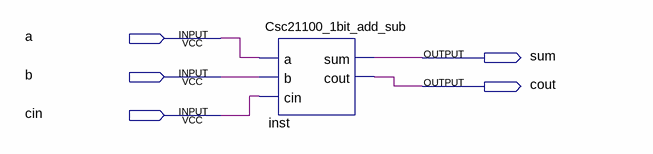
[diagram p0: schematic sheet]
// Quartus schematic Block.bdf as structural Verilog: 1 symbols, 5 pins
module Block (
  input  a,
  input  b,
  input  cin,
  output sum,
  output cout
);

  Csc21100_1bit_add_sub inst (.a(a), .b(b), .cin(cin), .sum(sum), .cout(cout));
endmodule
